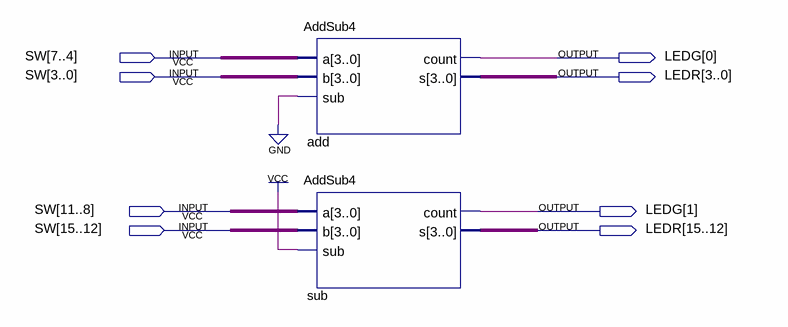
[diagram p0: schematic sheet]
// Quartus schematic AdderDemo.bdf as structural Verilog: 2 symbols, 8 pins
module AdderDemo (
  input  [15:0] SW,
  output [1:0] LEDG,
  output [15:0] LEDR
);

  AddSub4 add (.a(SW[7:4]), .b(SW[3:0]), .sub(1'b0), .count(LEDG[0]), .s(LEDR[3:0]));
  AddSub4 sub (.a(SW[11:8]), .b(SW[15:12]), .sub(1'b1), .count(LEDG[1]), .s(LEDR[15:12]));
endmodule
